# Altium schematic sheet Sheet1.SchDoc
size A
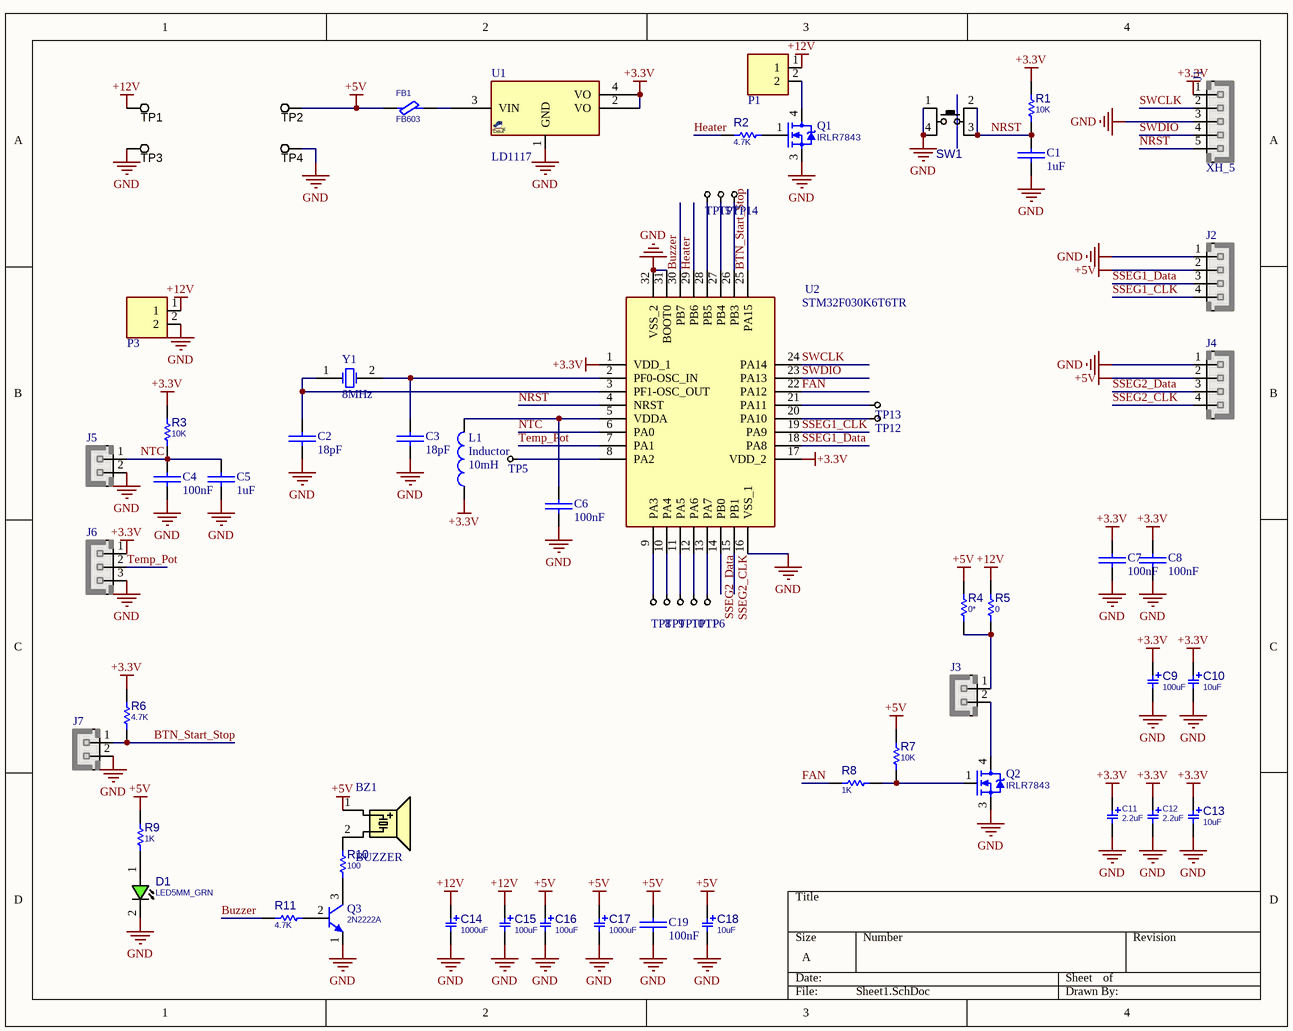
[diagram p0: Sheet1.SchDoc]

## Parts
BZ1  BUZZER  [BZ_C12]
C1  1uF  [Cap - 100nF]
C2  18pF  [Cap - 100nF]
C3  18pF  [Cap - 100nF]
C4  100nF  [Cap - 100nF]
C5  1uF  [Cap - 100nF]
C6  100nF  [Cap - 100nF]
C7  100nF  [Cap - 100nF]
C8  100nF  [Cap - 100nF]
C9  100uF  [C_EL_6X11]
C10  10uF  [C_EL_4X7]
C11  2.2uF  [C_TN_3216]
C12  2.2uF  [C_TN_3216]
C13  10uF  [C_EL_4X7]
C14  1000uF  [C_EL_10X12]
C15  100uF  [C_EL_6X11]
C16  100uF  [C_EL_6X11]
C17  1000uF  [C_EL_10X12]
C18  10uF  [C_EL_4X7]
C19  100nF  [Cap - 100nF]
D1  LED5MM_GRN  [LED5MM_GRN]
FB1  FB603  [L0805]
J1  value XH_5  [XH_5]  (hidden comment: PROG)
J2  SSEG1  [XH_4]  (value not drawn)
J3  FAN  [XH_2]  (value not drawn)
J4  SSEG2  [XH_4]  (value not drawn)
J5  NTC  [XH_2]  (value not drawn)
J6  TEMP POT  [XH_3]  (value not drawn)
J7  BTN_Start_Stop  [XH_2]  (value not drawn)
L1  Inductor  value 10mH  [AXIAL-0.4]
P1  HEATER  [PWL_2]  (value not drawn)
P3  POWER-IN  [PWL_2]  (value not drawn)
Q1  IRLR7843  [DPAK_3]
Q2  IRLR7843  [DPAK_3]
Q3  2N2222A  [TO92_3]
R1  10K  [R025W_AX04]
R2  4.7K  [R025W_AX04]
R3  10K  [R025W_AX04]
R4  0*  [R025W_AX04]
R5  0  [R025W_AX04]
R6  4.7K  [R025W_AX04]
R7  10K  [R025W_AX04]
R8  1K  [R025W_AX04]
R9  1K  [R025W_AX04]
R10  100  [R025W_AX04]
R11  4.7K  [R025W_AX04]
SW1  RST  [SWPBT_SPDT_6X6X5]  (value not drawn)
TP1  IN+  [TP80D50]  (value not drawn)  (no BOM)
TP2  OUT+  [TP80D50]  (value not drawn)  (no BOM)
TP3  IN-  [TP80D50]  (value not drawn)  (no BOM)
TP4  OUT-  [TP80D50]  (value not drawn)  (no BOM)
TP5  (no value)  [TP10]
TP6  (no value)  [TP10]
TP7  (no value)  [TP10]
TP8  (no value)  [TP10]
TP9  (no value)  [TP10]
TP10  (no value)  [TP10]
TP11  (no value)  [TP10]
TP12  (no value)  [TP10]
TP13  (no value)  [TP10]
TP14  (no value)  [TP10]
TP15  (no value)  [TP10]
U1  LD1117  [SOT223_4]
U2  STM32F030K6T6TR  [QFP80P900X900X160-32N]
Y1  8MHz  [XTAL Small]

## Nets
+3.3V: C7.1(+) C8.1(+) C9.1 C10.1 C11.1 C12.1 C13.1 J1.1 J6.1 L1.1 R1.2 R3.2 R6.2 U1.2(VO) U1.4(VO) U2.1(VDD_1) U2.17(VDD_2)
+5V: BZ1.1(A) C16.1 C17.1 C18.1 C19.1(+) FB1.1 J2.2 J4.2 R4.2 R7.2 R9.2 TP2.1
+12V: C14.1 C15.1 P1.1 P3.1 R5.2 TP1.1
GND: C1.2(-) C2.2(-) C3.2(-) C4.2(-) C5.2(-) C6.2(-) C7.2(-) C8.2(-) C9.2 C10.2 C11.2 C12.2 C13.2 C14.2 C15.2 C16.2 C17.2 C18.2 C19.2(-) D1.2(CATHODE) J1.3 J2.1 J4.1 J5.2 J6.3 J7.2 P3.2 Q1.3(S) Q2.3(S) Q3.1(E) SW1.1(P1) SW1.4(P2) TP3.1 TP4.1 U1.1(GND) U2.16(VSS_1) U2.31(BOOT0) U2.32(VSS_2)
BTN_Start_Stop: J7.1 R6.1 U2.25(PA15)
Buzzer: R11.2 U2.30(PB7)
FAN: R8.1 U2.22(PA12)
Heater: R2.1 U2.29(PB6)
NRST: C1.1(+) J1.5 R1.1 SW1.2(P3) SW1.3(P4) U2.4(NRST)
NTC: C4.1(+) C5.1(+) J5.1 R3.1 U2.6(PA0)
SSEG1_CLK: J2.4 U2.19(PA9)
SSEG1_Data: J2.3 U2.18(PA8)
SSEG2_CLK: J4.4 U2.15(PB1)
SSEG2_Data: J4.3 U2.14(PB0)
SWCLK: J1.2 U2.24(PA14)
SWDIO: J1.4 U2.23(PA13)
Temp_Pot: J6.2 U2.7(PA1)
NetBZ1_2: BZ1.2(B) R10.2
NetC2_1: C2.1(+) U2.3(PF1-OSC_OUT) Y1.1(OSC1)
NetC3_1: C3.1(+) U2.2(PF0-OSC_IN) Y1.2(OSC2)
NetC6_1: C6.1(+) L1.2 U2.5(VDDA)
NetD1_1: D1.1(ANODE) R9.1
NetFB1_2: FB1.2 U1.3(VIN)
NetJ3_1: J3.1 R4.1 R5.1
NetJ3_2: J3.2 Q2.4(D)
NetP1_2: P1.2 Q1.4(D)
NetQ1_1: Q1.1(G) R2.2
NetQ2_1: Q2.1(G) R7.1 R8.2
NetQ3_2: Q3.2(B) R11.1
NetQ3_3: Q3.3(C) R10.1
NetTP5_1: TP5.1(TP) U2.8(PA2)
NetTP6_1: TP6.1(TP) U2.13(PA7)
NetTP7_1: TP7.1(TP) U2.27(PB4)
NetTP8_1: TP8.1(TP) U2.9(PA3)
NetTP9_1: TP9.1(TP) U2.10(PA4)
NetTP10_1: TP10.1(TP) U2.11(PA5)
NetTP11_1: TP11.1(TP) U2.12(PA6)
NetTP12_1: TP12.1(TP) U2.20(PA10)
NetTP13_1: TP13.1(TP) U2.21(PA11)
NetTP14_1: TP14.1(TP) U2.26(PB3)
NetTP15_1: TP15.1(TP) U2.28(PB5)

## Library data of the parts
BZ1 = BUZZER_C12: Buzzer, 12X8.5mm, Magnetic Transducer; MANF: Buerklin, CUI; MANF_P#: CM12P, MT03-H1BHP, BMT1205XH7.5, CEM-1201(50); PARAM2: 3~7VCC; PARAM: 2048 ±200 Hz; PRICE: PRICE; VALUE: BUZZER
C1-C8 C19 = Cap-Bipolar: Bipolar Capacitor; Voltage: 100V; Designer: Saeid Jorablo; Organazation: ControTec; Adding Date: 1387/12/20
  C1 C5: Value: 1uF
  C2 C3: Value: 18pF
  C4 C6-C8 C19: Value: 100nF
C9 C15 C16 = CAP_THD_EL: CAP, THD, ELEC,; MANF_P#: MANF_PART#; PARAM2: 25V; DESC: DESCRIPTION; DIST#: MOUSER; PARAM: 20%; PRICE: 10= 5$; MANF: MANF; ASSEMBLY: ASSEMBLY; VALUE: 100uF
C10 C13 C18 = CAP_THD_EL_4X7: CAP, THD, ELEC,; MANF_P#: MANF_PART#; PARAM2: 25V; DESC: DESCRIPTION; DIST#: MOUSER; PARAM: 20%; PRICE: 10= 5$; MANF: MANF; ASSEMBLY: ASSEMBLY; VALUE: 10uF
C11 C12 = CAP_SMD_TAN: CAP, SMD, TAN,; PARAM2: -V; VALUE: 2.2uF
C14 C17 = CAP_THD_EL_10X12: CAP, THD, ELEC,; MANF_P#: MANF_PART#; PARAM2: 25V; DESC: DESCRIPTION; DIST#: MOUSER; PARAM: 20%; PRICE: 10= 5$; MANF: MANF; ASSEMBLY: ASSEMBLY; VALUE: 1000uF
D1 = LED_THD_5MM_GRN: LED, THD, 5MM, GREEN; DESC: DESCRIPTION; MANF_P#: MANF_PART#; PARAM2: 2.2V; MANF: MANF; ASSEMBLY: ASSEMBLY; PRICE: PRICE; VALUE: LED5MM_GRN
FB1 = FBEAD_SMD: FERRITE_Bead, SMD; MANF: MURATA; PARAM: 120@100MHz; PARAM2: 1A; MANF_P#: BLM15AG121SN1D; VALUE: FB603
J1 = XH_5: JST-XH pitch: 2.5mm; MANF_P#: JST-B5B-XHA; MANF: JST
J2 J4 = XH_4: JST-XH pitch: 2.5mm; VALUE: HHDR_4
J3 J5 J7 = XH_2: JST-XH pitch: 2.5mm; VALUE: HHDR_2
J6 = XH_3: JST-XH pitch: 2.5mm; VALUE: HHDR_3
L1 = Inductor: Code_IEC: 1005; Published: 8-Jun-2000; LatestRevisionDate: 29-May-2009; LatestRevisionNote: IPC-7351 Footprint Added.; PackageReference: 0402-A; Publisher: Altium Limited; PackageDescription: Chip Inductor; Code_JEITA: 0402
P1 P3 = CONN_PWL_2: Power Terminal 2pin,Header, 2-Pin; VALUE: CONN_PWL_2
Q1 Q2 = MOSN_IRLR7843_DPAK: HEXFET Power MOSFET; ASSEMBLY: ASSEMBLY; MANF_P#: IRLR7843; VALUE: IRLR7843
Q3 = NPN_2N2222A_TO92: BJT, NPN, 40v, 0.6A, THD, TO92; PARAM: 0.6A, hFE100~300; PARAM2: 40v, 625mW; MANF: DIOTEC; MANF_P#: 2N2222A; VALUE: 2N2222A
R1-R11 = RES_THD: RESISTOR, THD; MANF_P#: RK73H1ETTP4701F; MANF: KOA SPEER; PARAM: 0.063W; DESC: DESCRIPTION; DIST#: MOUSER; PARAM2: 1%; ASSEMBLY: ASSEMBLY; PRICE: 100= 0.5$
  R1 R3 R7: VALUE: 10K
  R2 R6 R11: VALUE: 4.7K
  R4: VALUE: 0*
  R5: VALUE: 0
  R8 R9: VALUE: 1K
  R10: VALUE: 100
SW1 = SWPBT_SPDT_6X6X5: SWITCH, PUSH BUTTON, TACTILE, THD, SPDT, 4X4MM; DESC: DESCRIPTION; MANF: -; VALUE: PUSHBUTTON; ASSEMBLY: ASSEMBLY; PARAM: PARAM; PRICE: PRICE; MANF_P#: -
TP1-TP4 = TESTPOINT_PROBE: TEST POINT; MANF: MANF; MANF_P#: MANF_P#; VALUE: VALUE
TP5-TP15 = Test Point: Company: SJ Libraries; Designer: Eng. Saeid Jorablo; Mounting Technology: Surface Mount\Through-Hole; ComponentLink1Description: Datasheet; Pin Count: 0; Update Date: 6/3/2012; Category: MISC; HelpURL: http://s3.picofile.com/file/7443264187/Coming_Soon_logo.gif
U1 = VREG_1117_SOT223: REG, Linear, LDO1V, 0.8A, SOT-223; MANF_P#: LD1117, LM1117, AMS1117, TLV1117, REG1117, NCP1117, LT1117, SPX1117; MANF: TI, ON, ST; PARAM2: 1.2/1.5/1.8/2.5/2.85/3.3/5V; PARAM: LDO1V, 0.8A; VALUE: LD1117
U2 = STM32F030K6T6TR: Integrated Circuit; Manufacturer_Name: STMicroelectronics; Datasheet Link: http://www.st.com/content/ccc/resource/technical/document/datasheet/a4/5d/0b/0e/87/c4/4d/71/DM00088500.pdf/files/DM00088500.pdf/jcr:content/translations/en.DM00088500.pdf; Height: 1.6mm; Manufacturer_Part_Number: STM32F030K6T6TR; Mouser Part Number: 511-STM32F030K6T6TR; Mouser Price/Stock: https://www.mouser.co.uk/ProductDetail/STMicroelectronics/STM32F030K6T6TR?qs=9MuLHSklicort60U4QZudQ%3D%3D; Arrow Part Number: STM32F030K6T6TR; Arrow Price/Stock: https://www.arrow.com/en/products/stm32f030k6t6tr/stmicroelectronics
Y1 = XTAL: XTAL Crystal; Company: E.P.I.L; Design Date: 11/04/2011; Value: 8MHz